# Altium schematic sheet 12VInputProtection.SchDoc
size A4
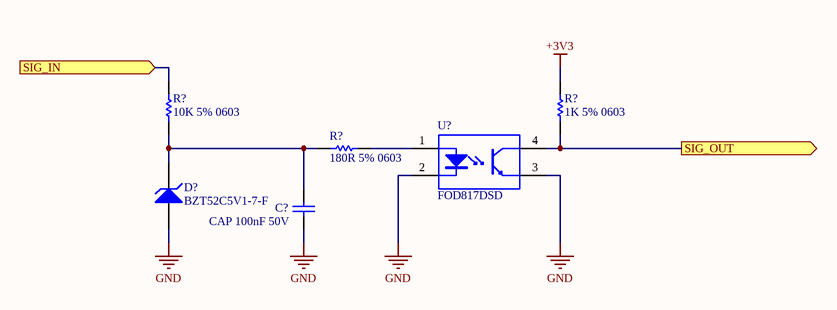
[diagram p0: 12VInputProtection.SchDoc]

## Parts
(Parts that share a designator on the sheet are numbered #1, #2 ... from top to bottom, then left to right.)
C?  CAP 100nF 50V  [CAPC0603(1608)100_L]
D?  BZT52C5V1-7-F  [DIOD-SOD123_V]
R?#1  10K 5% 0603  [RESC0603(1608)_N]
R?#2  1K 5% 0603  [RESC1608X55X25ML10T15]
R?#3  180R 5% 0603  [RESC1608X55X25LL10T15]
U?  FOD817DSD  [FAIR-MDIP-4_V]

## Ports
SIG_IN (in), SIG_OUT (out)

## Nets
+3V3: R?#2.2
GND: C?.2 D?.1(A) U?.2(CATHODE) U?.3(EMITTER)
SIG_IN: R?#1.1 ; port SIG_IN
SIG_OUT: R?#2.1 U?.4(COLLECTOR) ; port SIG_OUT
NetC?_1: C?.1 D?.2(K) R?#1.2 R?#3.1
NetR?#3_2: R?#3.2 U?.1(ANODE)

## Notes on the sheet
- Title
- Size:
- Date:
- A4
- Number:
- Time:
- Revision:
- Sheet
- of
- File:

## Library data of the parts
C? = CMP-1035-02591-1: CAP 100nF 50V ±5% 0603 (1608 Metric) Thickness 1mm SMD; Tolerance: Â±5%; Case-Metric: 1608; Case-EIA: 0603; Rated Voltage: 50 V; Max Thickness: 1 mm; Technology: SMT; Value: 100nF
D? = CMP-2000-05976-1: Surface Mount Zener Diode, 5.1 V, -65 to 150 degC, 2-Pin SMD (SOD-123), RoHS, Tape and Reel; Manufacturer: DiodesIncorporated; Unit Weight: 0.000353oz; Zz - Zener Impedance: 60Ohms; Vz - Zener Voltage: 5.1V; Pd - Power Dissipation: 500mW; Zener Current: 5mA; Ir - Reverse Current: 2uA; Voltage Temperature Coefficient: -0.75mV/C; Configuration: Single; Voltage Tolerance: 6%; Height: 1.35mm; Width: 1.7mm; Minimum Operating Temperature: -65C; Series: BZT52C5; Package Description: 2-Pin Surface Mount Device, Body 2.7 x 1.55 mm; Length: 2.85mm; Mounting Technology: SurfaceMount; Brand: DiodesIncorporated; Factory Pack Quantity: 3000; Product Category: ZenerDiodes; RoHS: True; Manufacturer URL: http://www.diodes.com/; Termination Style: SMD/SMT; Package / Case: SOD-123; Packaging: Reel; Package Reference: SOD123; Datasheet Version: Rev. 37-2, 09/2012; Maximum Operating Temperature: +150C; Datasheet URL: http://www.diodes.com/_files/datasheets/ds18004.pdf; Mounting Style: SMD/SMT
R?#1 = CMP-1012-00098-1: 10K 0.1W 5% 0603 (1608 Metric)  SMD; Case-EIA: 0603; Value: 10000.00 Ohm; Case-Metric: 1608; Technology: SMT; Tolerance: 5 %; Power: 0.1 W
R?#2 = CMP-1659-00009-4: Chip Resistor, 1 KOhm, +/-1%, 0.1 W, -55 to 155 degC, 0603 (1608 Metric), RoHS, Tape and Reel; Manufacturer: Yageo; Voltage Rating: 50 V; ComponentLink2URL: http://www.yageo.com/documents/recent/PYu-RC_Group_51_RoHS_L_04.pdf; Max Operating Temperature: 155 degC; PackageDescription: 2-Pin Surface Mount Device, Body 1.6 x 0.8 mm; Packaging: Tape and Reel; ComponentLink3Description: Package Specification; REACH SVHC: No SVHC; Mount: Surface Mount; ComponentLink2Description: Datasheet; Length: 1.6 mm; PackageReference: 0603; Height: 0.45 mm; DatasheetVersion: Rev. 4, 02/2016; Min Operating Temperature: -55 degC; ComponentLink1Description: Manufacturer URL; Package Quantity: 200; RoHSCompliant: true; ComponentLink3URL: http://www.farnell.com/datasheets/443971.pdf; Pins: 2; Mounting Technology: Surface Mount; ComponentLink1URL: http://www.yageo.com/
R?#3 = CMP-2000-06929-1: Chip Resistor, 180 Ohm, +/- 1%, 0.1 W, -55 to 155 degC, 0603 (1608 Metric), RoHS, Tape and Reel; Manufacturer: Yageo; Voltage Rating: 50V; Power Rating: 100mW; Resistance: 180Ohms; Temperature Coefficient: 100PPM/C; Package Reference: 0603; Package Description: 2-Pin Surface Mount Device, Body 1.6 x 0.8 mm; Case Code - mm: 1608; Mounting Technology: SurfaceMount; Packaging: Reel; Tolerance: 1%; Manufacturer URL: http://www.yageo.com/; Series: RC; Operating Temperature Range: -55Cto+155C; Product: ThickFilmResistorsGeneralPurpose; Termination Style: SMD/SMT; Case Code - in: 0603; Datasheet Version: Rev. 7, 05/2017; Datasheet URL: http://www.yageo.com/documents/recent/PYu-RC_Group_51_RoHS_L_7.pdf
U? = CMP-2000-06281-1: Phototransistor Optocoupler, 4 us Rise, 3 us Fall, 5000 Vrms, -55 to 110 degC, 4-Pin MDIP, RoHS, Tape and Reel; Manufacturer: Fairchild Semiconductor; Current Transfer Ratio (Min): 300%@5mA; Rise / Fall Time (Typ): 4µs,3µs; Vce Saturation (Max): 200mV; Current Transfer Ratio (Max): 600%@5mA; Package Version: 10/2014; Current - DC Forward (If) (Max): 50mA; Online Catalog: FOD617,814,817Series; Voltage - Output (Max): 70V; Number of Channels: 1; Input Type: DC; Voltage - Forward (Vf) (Typ): 1.2V; Other Names: FOD817DSDDKR; Output Type: Transistor; Packaging: Digi-Reel®; Category: Isolators; Package / Case: 4-SMD,GullWing; Voltage - Isolation: 5000Vrms; Mounting Technology: SurfaceMount; Series: -; Mounting Type: SurfaceMount; Supplier Device Package: 4-SMD; Family: Optoisolators-Transistor,PhotovoltaicOutput; Standard Package: 1; Package Description: 4-Pin Surface Mount Device, Body 6.5 x 4.6 mm, Pitch 2.54 mm; Datasheet Version: Rev. 2.8, 11/2015; Package Reference: MDIP 4L; Manufacturer URL: https://www.fairchildsemi.com/; Current - Output / Channel: 50mA; Turn On / Turn Off Time (Typ): -; Operating Temperature: -55°C~110°C; Datasheet URL: https://www.fairchildsemi.com/datasheets/FO/FOD817D.pdf; Package URL: https://www.fairchildsemi.com/package-drawings/N0/N04C.pdf